# Altium schematic sheet ETHERNET.SchDoc
size A3; SheetNumber: 14; SheetTotal: 21
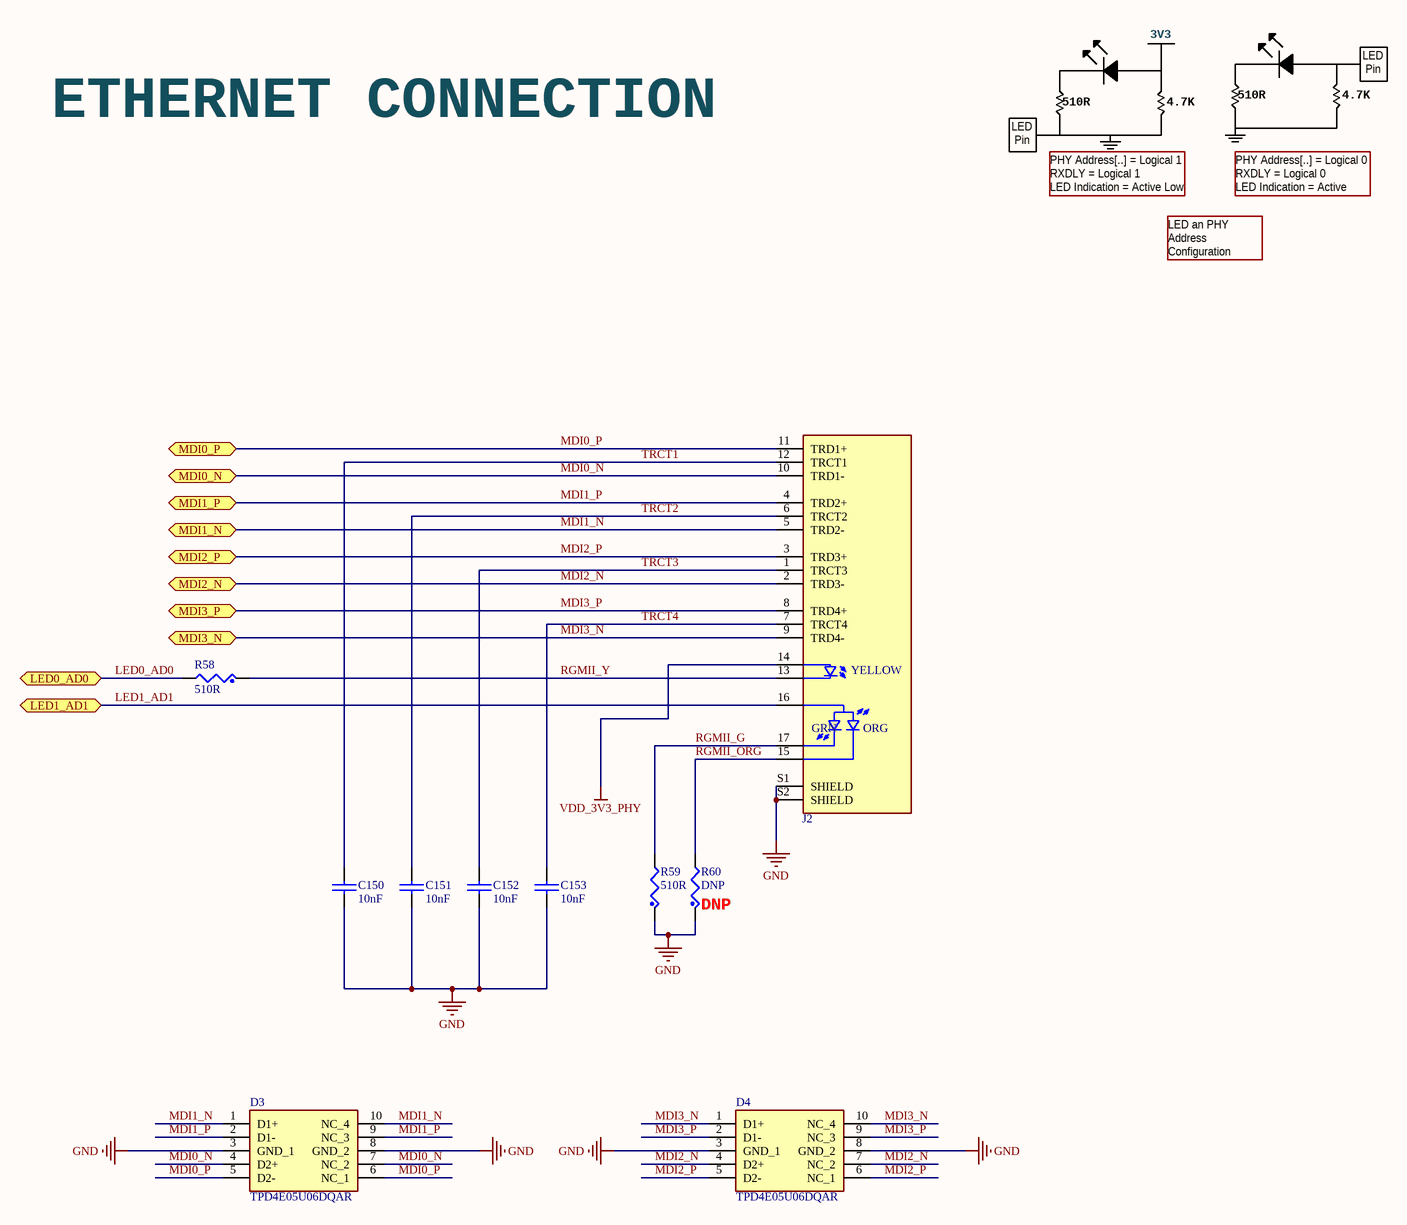
[diagram p0: ETHERNET.SchDoc]

## Parts
C150  10nF  [0402_CC - C]
C151  10nF  [0402_CC - C]
C152  10nF  [0402_CC - C]
C153  10nF  [0402_CC - C]
D3  TPD4E05U06DQAR  [DQA(R-PUSON-N10)]
D4  TPD4E05U06DQAR  [DQA(R-PUSON-N10)]
J2  L829-1J1T-43  [BEL_L829-1J1T-43]  (value not drawn)
R58  510R  [0402_CR]
R59  510R  [0402_CR]
R60  DNP  [0402_CR]

## Ports
LED0_AD0 (bidir), LED1_AD1 (bidir), MDI0_N (bidir), MDI0_P (bidir), MDI1_N (bidir), MDI1_P (bidir), MDI2_N (bidir), MDI2_P (bidir), MDI3_N (bidir), MDI3_P (bidir)

## Nets
GND: C150.2 C151.2 C152.2 C153.2 D3.3(GND_1) D3.8(GND_2) D4.3(GND_1) D4.8(GND_2) J2.S1(SHIELD) J2.S2(SHIELD) R59.1 R60.1
VDD_3V3_PHY: J2.14(YA_1)
LED0_AD0: R58.2 ; port LED0_AD0
LED1_AD1: J2.16(CA) ; port LED1_AD1
MDI0_N: D3.4(D2+) D3.7(NC_2) J2.10(TRD1-) ; port MDI0_N
MDI0_P: D3.5(D2-) D3.6(NC_1) J2.11(TRD1+) ; port MDI0_P
MDI1_N: D3.1(D1+) D3.10(NC_4) J2.5(TRD2-) ; port MDI1_N
MDI1_P: D3.2(D1-) D3.9(NC_3) J2.4(TRD2+) ; port MDI1_P
MDI2_N: D4.4(D2+) D4.7(NC_2) J2.2(TRD3-) ; port MDI2_N
MDI2_P: D4.5(D2-) D4.6(NC_1) J2.3(TRD3+) ; port MDI2_P
MDI3_N: D4.1(D1+) D4.10(NC_4) J2.9(TRD4-) ; port MDI3_N
MDI3_P: D4.2(D1-) D4.9(NC_3) J2.8(TRD4+) ; port MDI3_P
RGMII_G: J2.17(GK_1) R59.2
RGMII_ORG: J2.15(OK_1) R60.2
RGMII_Y: J2.13(YK_1) R58.1
TRCT1: C150.1 J2.12(TRCT1)
TRCT2: C151.1 J2.6(TRCT2)
TRCT3: C152.1 J2.1(TRCT3)
TRCT4: C153.1 J2.7(TRCT4)

## Notes on the sheet
- 3V3
- LED
  Pin
- ETHERNET CONNECTION
- 510R
- 4.7K
- PHY Address[..] = Logical 1
  RXDLY = Logical 1
  LED Indication = Active Low
- PHY Address[..] = Logical 0
  RXDLY = Logical 0
  LED Indication = Active High
- LED an PHY Address Configuration
- (near R60) DNP
- (in symbol L829-1J1T-43) YELLOW; GRN; ORG

## Library data of the parts
C150-C153 = CAP_NP: CLASS: DISCRETE
D3 D4 = TPD4E05U06DQAR: ESD Suppressors / TVS Diodes 4Chnl U-Lo Capacitnc IEC ESD Prot Diodes; Mfr: Texas Instruments; Datasheet Link: http://www.ti.com/lit/gpn/tpd4e05u06; Mfr_Part_No: TPD4E05U06DQAR; Mouser No: 595-TPD4E05U06DQAR; Mouser Price/Stock: https://www.mouser.co.uk/ProductDetail/Texas-Instruments/TPD4E05U06DQAR?qs=%2FCrDlo5IrVPi4woOvWz0qA%3D%3D; Arrow Part Number: TPD4E05U06DQAR; Arrow Price/Stock: https://www.arrow.com/en/products/tpd4e05u06dqar/texas-instruments?region=nac
J2 = L829-1J1T-43: MagJack 1000BASE-T | 1X1 | 3w-OG/Y | Tab Up | Low Profile | RoHS; Mfr: Bel Magnetic Solutions; Mfr_Part_No: L829-1J1T-43; Supplier 1: Mouser; Supplier Part Number 1: 530-L829-1J1T-43
R58-R60 = RES: CLASS: DISCRETE